# EAGLE design Stefan 2.0 (EAGLE 9.6.2)

## Sheet 1 of 2
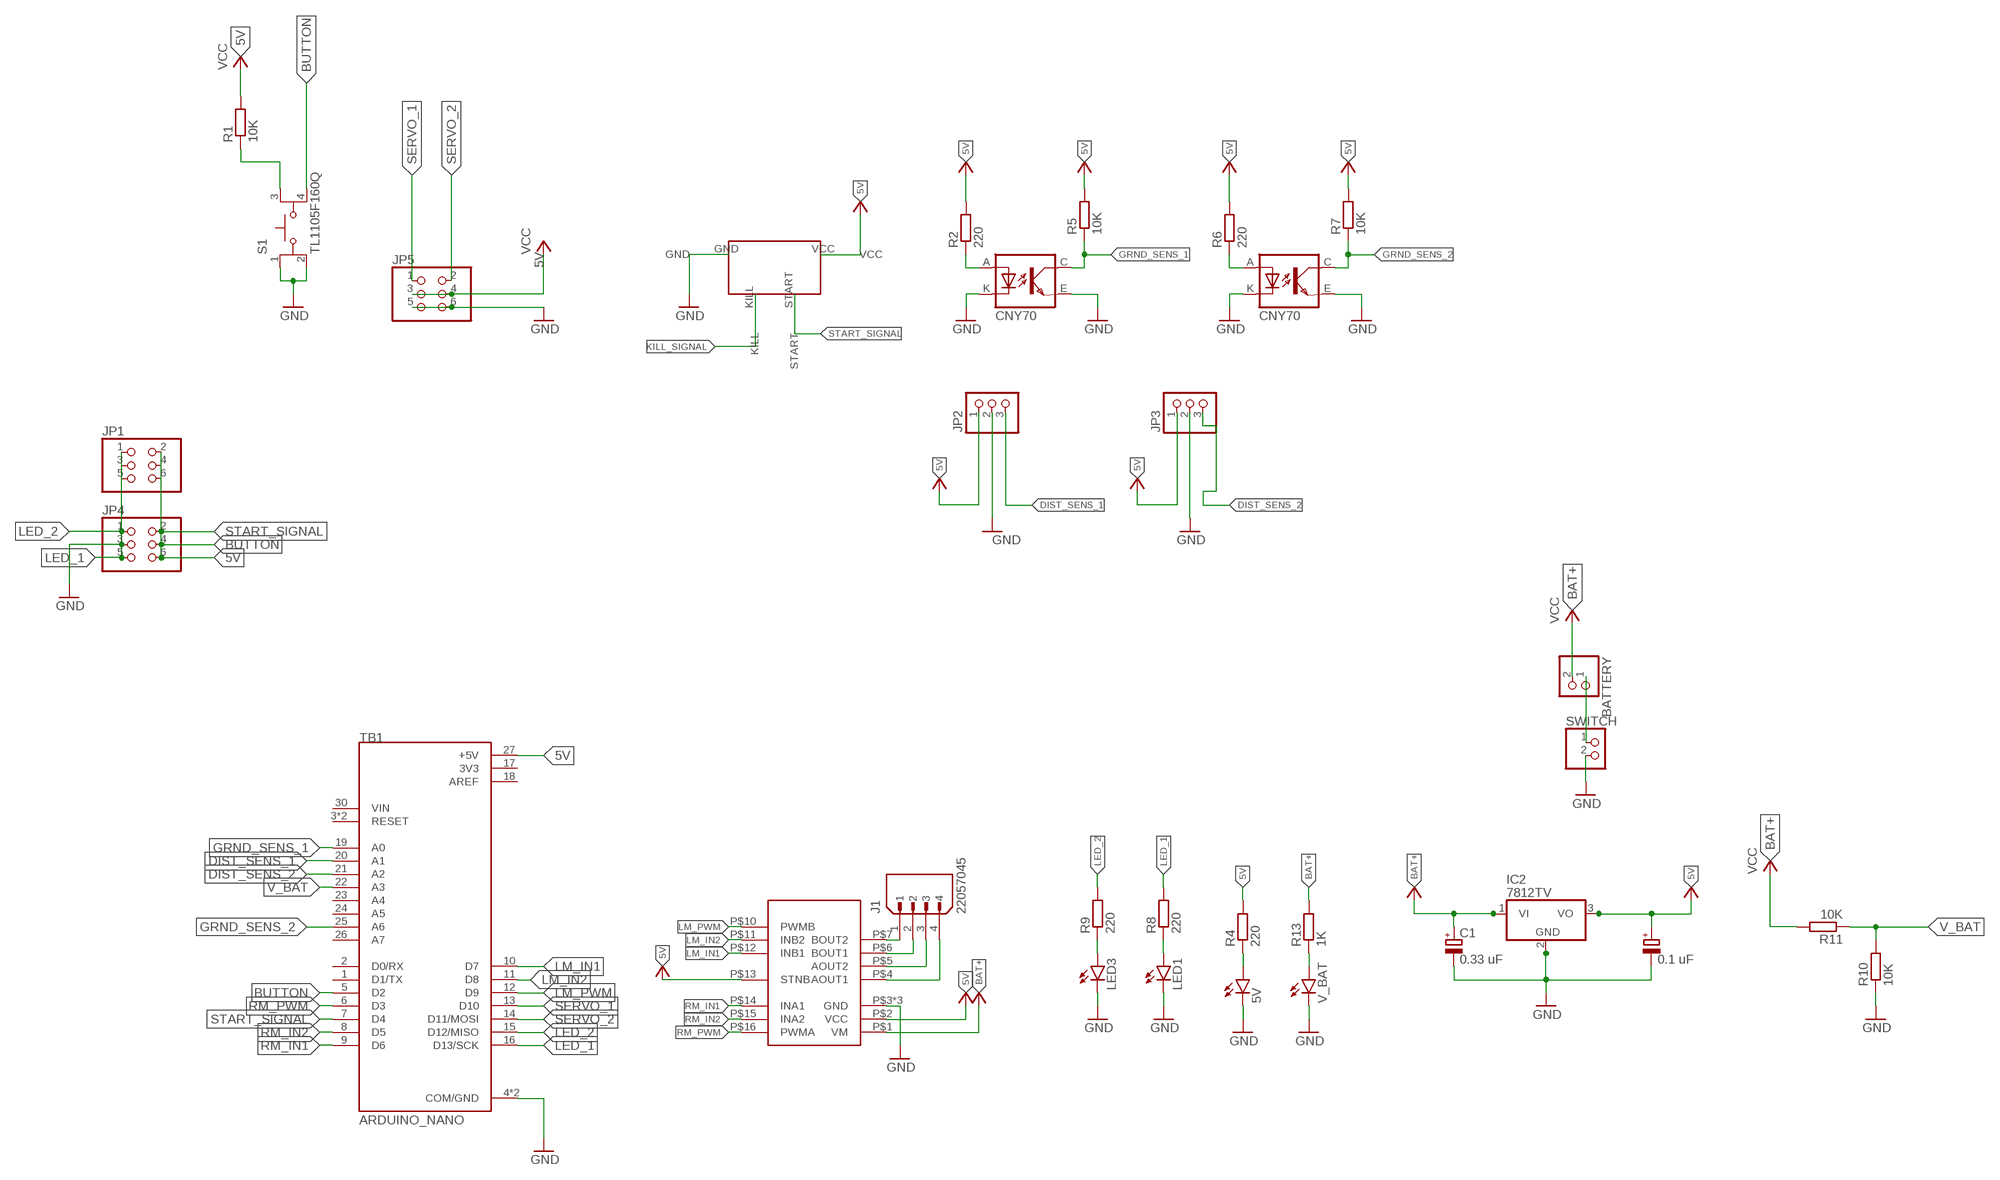
[diagram p0: schematic, sheet 1]

### Parts
5V  LED5MM  [LED5MM]
BATTERY  PINHD-1X2  [1X02]
C1  0.33 uF  CPOL-EUTAP5-70  [TAP5-70]
C2  0.1 uF  CPOL-EUSANYO_A  [SANYO-OSCON_A]
IC2  7812TV  [TO220V]
J1  22057045  [MOLEX_22057045]
JP1  PINHD-2X3  [2X03]
JP2  PINHD-1X3  [1X03]
JP3  PINHD-1X3  [1X03]
JP4  PINHD-2X3  [2X03]
JP5  PINHD-2X3  [2X03]
LED1  LED5MM  [LED5MM]
LED3  LED5MM  [LED5MM]
R1  10K  R-EU_R0805  [R0805]
R2  220  R-EU_R0805  [R0805]
R4  220  R-EU_R0805  [R0805]
R5  10K  R-EU_R0805  [R0805]
R6  220  R-EU_R0805  [R0805]
R7  10K  R-EU_R0805  [R0805]
R8  220  R-EU_R0805  [R0805]
R9  220  R-EU_R0805  [R0805]
R10  10K  R-EU_R0805  [R0805]
R11  10K  R-EU_R0805  [R0805]
R13  1K  R-EU_R0805  [R0805]
S1  TL1105F160Q  [SW_TL1105F160Q]
SUMO_START_MODULE1  SUMO_START_MODULE  [SUMO_START_MODULE]
SWITCH  PINHD-1X2  [1X02]
TB1  ARDUINO_NANO  [SHIELD_ARDUINO_NANO]
TB2  TB6612MODULE  [TB6612MODULE]
U$2  CNY70  [4]
U$4  CNY70  [4]
V_BAT  LEDCHIPLED_1206  [CHIPLED_1206]

### Nets
5V: C2.+ IC2.3(VO) JP1.6 JP2.1 JP3.1 JP4.6 JP5.3 JP5.4 R1.2 R2.2 R4.2 R5.2 R6.2 R7.2 SUMO_START_MODULE1.VCC TB1.27(+5V) TB2.P$2(VCC) TB2.P$13(STNB) ; supply symbol labelled VCC
BAT+: BATTERY.2 C1.+ IC2.1(VI) R11.2 R13.2 TB2.P$1(VM) ; supply symbol labelled VCC
BUTTON: JP1.4 JP4.4 S1.4 TB1.5(D2)
DIST_SENS_1: JP2.3 TB1.20(A1)
DIST_SENS_2: JP3.3 TB1.21(A2)
GND: 5V.K(C) C1.- C2.- IC2.2(GND) JP1.3 JP2.2 JP3.2 JP4.3 JP5.5 JP5.6 LED1.K(C) LED3.K(C) R10.1 S1.1 S1.2 SUMO_START_MODULE1.GND SWITCH.2 TB1.4(COM/GND) TB1.29(COM/GND) TB2.P$3(GND) TB2.P$8(GND) TB2.P$9(GND) U$2.E(EMI) U$2.K(C) U$4.E(EMI) U$4.K(C) V_BAT.C
GRND_SENS_1: R5.1 TB1.19(A0) U$2.C(COL)
GRND_SENS_2: R7.1 TB1.25(A6) U$4.C(COL)
KILL_SIGNAL: SUMO_START_MODULE1.KILL
LED_1: JP1.5 JP4.5 R8.2 TB1.16(D13/SCK)
LED_2: JP1.1 JP4.1 R9.2 TB1.15(D12/MISO)
LM_IN1: TB1.10(D7) TB2.P$12(INB1)
LM_IN2: TB1.11(D8) TB2.P$11(INB2)
LM_OUT1: J1.2 TB2.P$6(BOUT1)
LM_OUT2: J1.1 TB2.P$7(BOUT2)
LM_PWM: TB1.12(D9) TB2.P$10(PWMB)
N$1: BATTERY.1 SWITCH.1
N$6: LED3.A R9.1
N$8: R2.1 U$2.A
N$9: R6.1 U$4.A
N$10: LED1.A R8.1
N$13: 5V.A R4.1
N$15: R13.1 V_BAT.A
N$16: R1.1 S1.3
RM_IN1: TB1.9(D6) TB2.P$14(INA1)
RM_IN2: TB1.8(D5) TB2.P$15(INA2)
RM_OUT1: J1.4 TB2.P$4(AOUT1)
RM_OUT2: J1.3 TB2.P$5(AOUT2)
RM_PWM: TB1.6(D3) TB2.P$16(PWMA)
SERVO_1: JP5.1 TB1.13(D10)
SERVO_2: JP5.2 TB1.14(D11/MOSI)
START_SIGNAL: JP1.2 JP4.2 SUMO_START_MODULE1.START TB1.7(D4)
V_BAT: R10.2 R11.1 TB1.22(A3)
Unconnected: TB1.1(D1/TX) TB1.2(D0/RX) TB1.3(RESET) TB1.23(A4) TB1.24(A5) TB1.26(A7) TB1.28(RESET) TB1.30(VIN)

## Sheet 2 of 2
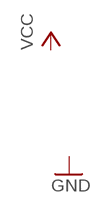
[diagram p1: schematic, sheet 2]

## Power pins joined to a net without a drawn wire
3V3: TB1.17(3V3)
AREF: TB1.18(AREF)

## Library data of the parts
5V LED1 LED3 V_BAT = led:LED: LED OSRAM: - CHIPLED LG R971, LG N971, LY N971, LG Q971, LY Q971, LO R971, LY R971 LH N974, LH R974 LS Q976, LO Q976, LY Q976 LO Q996 - Hyper CHIPLED LW Q18S LB Q993, LB Q99A, LB R99A - SideLED LS A670, LO A670, LY A670, LG A670, LP A670 LB A673, LV A673, LT A673, LW A673 LH A674 LY A675 LS A676, LA A676, LO A676, LY A676, LW A676 LS A679, LY A679, LG A679 - Hyper Micro SIDELED® LS Y876, LA Y876, LO Y876, LY Y876 LT Y87S - SmartLED LW L88C, LW L88S LB L89C, LB L89S, LG L890 LS L89K, LO L89K, LY L89K LS L896, LA L896, LO L896, LY L896 - TOPLED LS T670, LO T670, LY T670, LG T670, LP T670 LSG T670, LSP T670, LSY T670, LOP T670, LYG T670 LG T671, LOG T671, LSG T671 LB T673, LV T673, LT T673, LW T673 LH T674 LS T676, LA T676, LO T676, LY T676, LB T676, LH T676, LSB T676, LW T676 LB T67C, LV T67C, LT T67C, LS T67K, LO T67K, LY T67K, LW E67C LS E67B, LA E67B, LO E67B, LY E67B, LB E67C, LV E67C, LT E67C LW T67C LS T679, LY T679, LG T679 LS T770, LO T770, LY T770, LG T770, LP T770 LB T773, LV T773, LT T773, LW T773 LH T774 LS E675, LA E675, LY E675, LS T675 LS T776, LA T776, LO T776, LY T776, LB T776 LHGB T686 LT T68C, LB T68C - Hyper Mini TOPLED® LB M676 - Mini TOPLED Santana® LG M470 LS M47K, LO M47K, LY M47K Source: http://www.osram.convergy.de LUXEON: - LUMILED® LXK2-PW12-R00, LXK2-PW12-S00, LXK2-PW14-U00, LXK2-PW14-V00 LXK2-PM12-R00, LXK2-PM12-S00, LXK2-PM14-U00 LXK2-PE12-Q00, LXK2-PE12-R00, LXK2-PE12-S00, LXK2-PE14-T00, LXK2-PE14-U00 LXK2-PB12-K00, LXK2-PB12-L00, LXK2-PB12-M00, LXK2-PB14-N00, LXK2-PB14-P00, LXK2-PB14-Q00 LXK2-PR12-L00, LXK2-PR12-M00, LXK2-PR14-Q00, LXK2-PR14-R00 LXK2-PD12-Q00, LXK2-PD12-R00, LXK2-PD12-S00 LXK2-PH12-R00, LXK2-PH12-S00 LXK2-PL12-P00, LXK2-PL12-Q00, LXK2-PL12-R00 Source: www.luxeon.com KINGBRIGHT: KA-3528ASYC Source: www.kingbright.com
BATTERY SWITCH = pinhead:PINHD-1X2: PIN HEADER
C1 C2 = rcl:CPOL-EU: POLARIZED CAPACITOR, European symbol; SPICEPREFIX: C
IC2 = linear:78*: Positive VOLTAGE REGULATOR Source: http://cache.national.com/ds/LM/LM78L05.pdf http://www.fairchildsemi.com/ds/LM/LM7805.pdf
J1 = 22057045:22057045: 2.50mm Pitch, Mini-SPOX PCB Header, Single Row, Through Hole, Tin Plating, Friction Lock, 4 Circuits, Bag, 3.50mm PC Tail Length Check availability <https://pricing.snapeda.com/parts/22057045/Molex/view-part?ref=eda>; AVAILABILITY: In Stock; DESCRIPTION: Conn Shrouded Header (4 Sides) HDR 4 POS 2.5mm Solder RA Side Entry Thru-Hole SPOX™ Bag; MF: Molex; MP: 22057045; PACKAGE: None; PRICE: None
JP1 JP4 JP5 = pinhead:PINHD-2X3: PIN HEADER
JP2 JP3 = pinhead:PINHD-1X3: PIN HEADER
R1 R2 R4-R11 R13 = rcl:R-EU_: RESISTOR, European symbol; SPICEPREFIX: R
S1 = TL1105F160Q:TL1105F160Q: Check availability <https://pricing.snapeda.com/parts/TL1105F160Q/E-Switch/view-part?ref=eda>; AVAILABILITY: In Stock; DESCRIPTION: SWITCH TACTILE SPST-NO 0.05A 12V; MF: E-Switch; MP: TL1105F160Q; PACKAGE: None; PRICE: None; PURCHASE-URL: https://pricing.snapeda.com/search/part/TL1105F160Q/?ref=eda
SUMO_START_MODULE1 = SUMO_START_MODULE:SUMO_START_MODULE
TB1 = ARDUINO_NANO:ARDUINO_NANO: Arduino Nano, Through Hole Check availability <https://pricing.snapeda.com/parts/Arduino%20Nano/Arduino/view-part?ref=eda>; AVAILABILITY: Not in stock; DESCRIPTION: Small, complete, and breadboard-friendly board based on the ATmega328 (Arduino Nano 3.x); MF: Arduino; MP: Arduino Nano; PACKAGE: Non-Standard Arduino; PRICE: None
TB2 = TB6612MODULE:TB6612MODULE
U$2 U$4 = CNY70:CNY70: Check availability <https://pricing.snapeda.com/parts/CNY70/Vishay%20Semiconductors/view-part?ref=eda>; AVAILABILITY: In Stock; DESCRIPTION: Optical Switches, Reflective, Phototransistor Output Reflective Optical Sensor w/Trans Out; MF: Vishay Semiconductors; MP: CNY70; PACKAGE: None; PRICE: None; PURCHASE-URL: https://pricing.snapeda.com/search/part/CNY70/?ref=eda

## Board
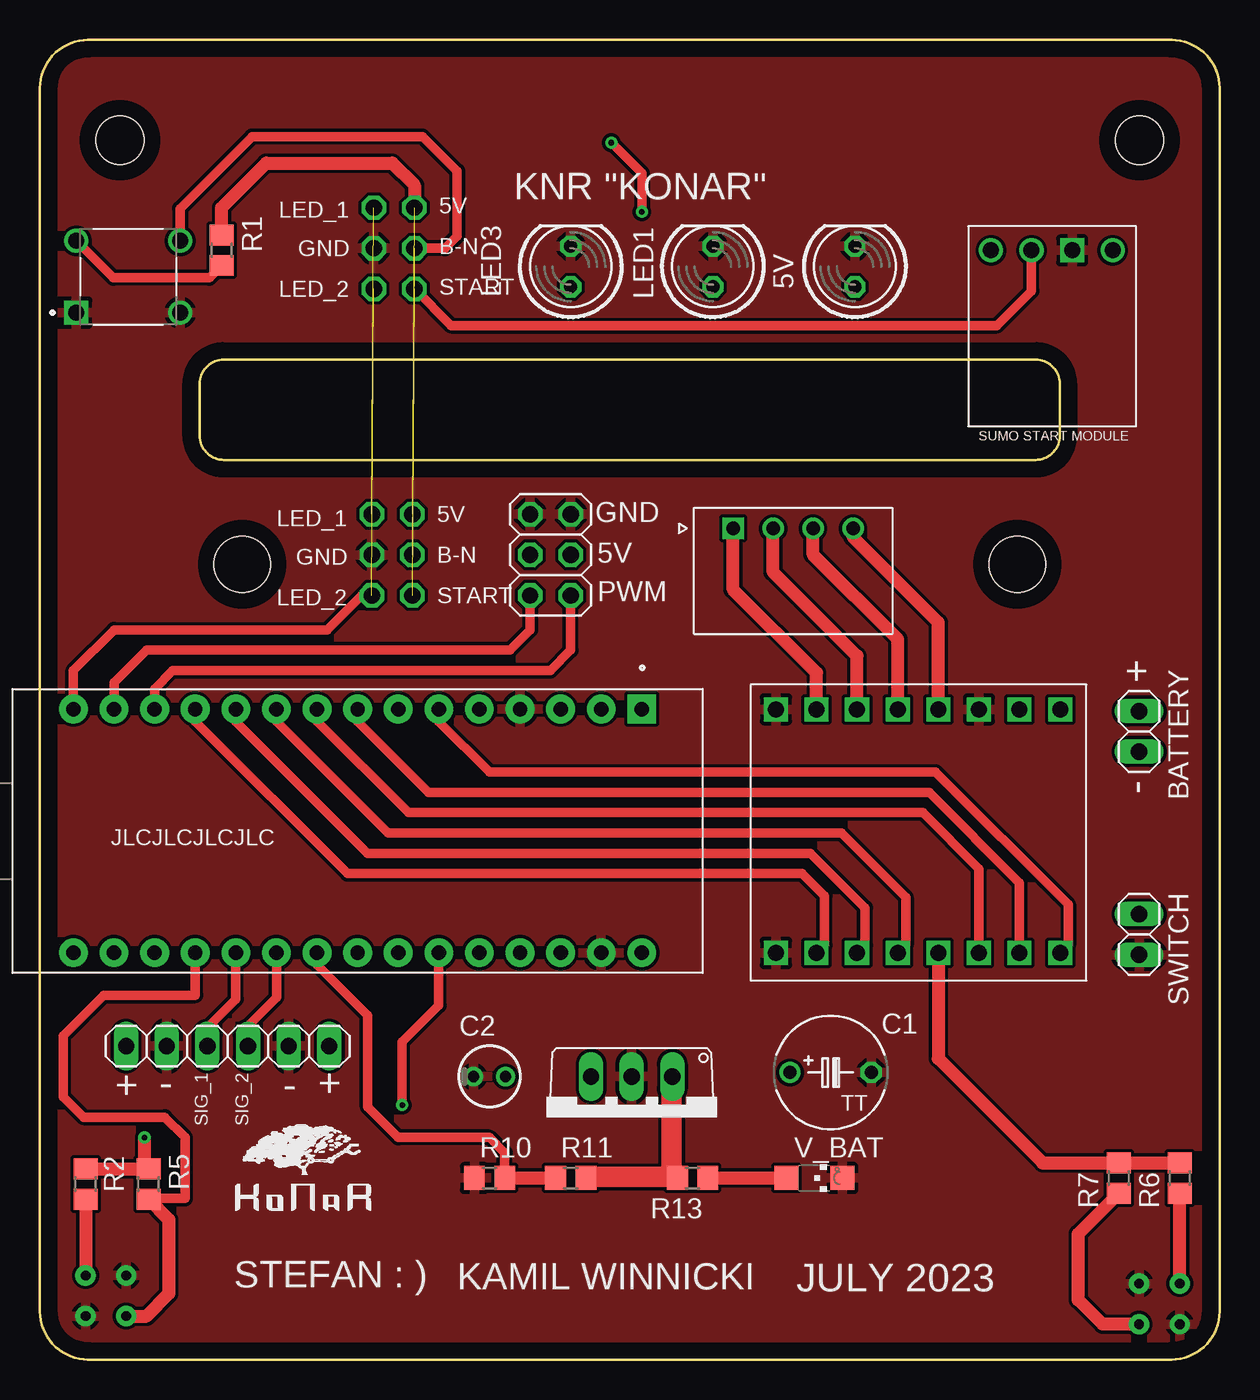
[diagram p2: board, top side]
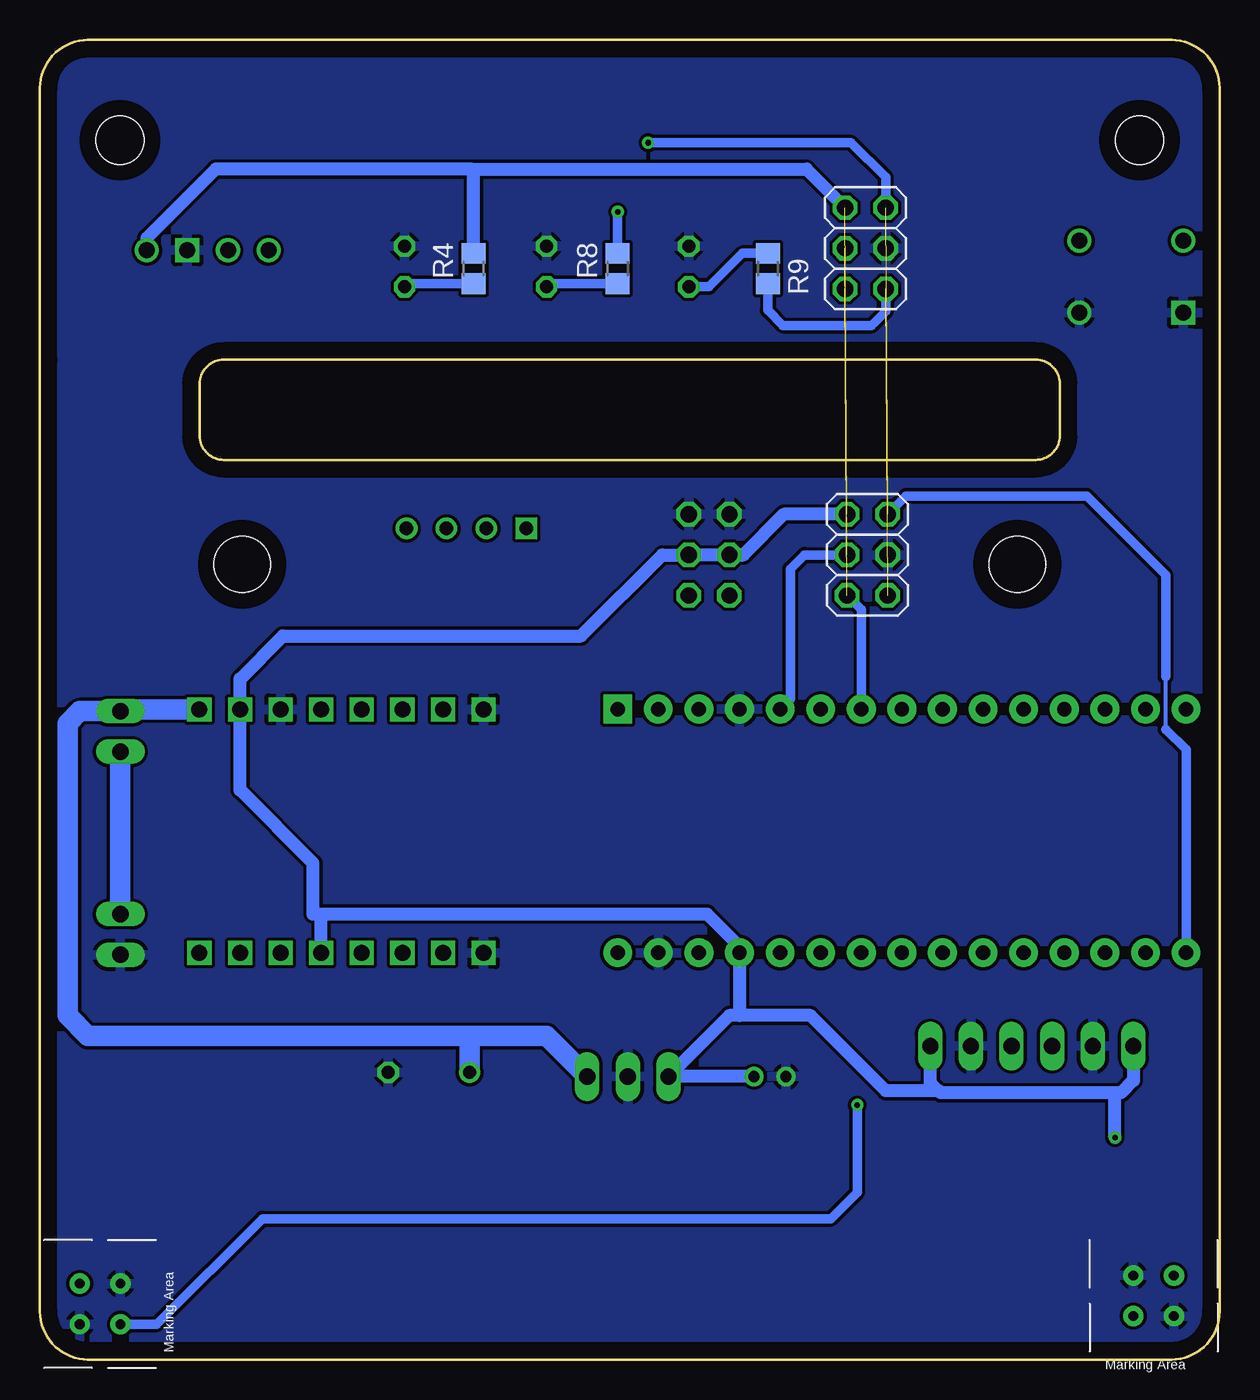
[diagram p3: board, bottom side, seen from below]

Size 73.8 x 82.56 mm. Coordinates in mm from the lower left corner, seen from the top.
Outline: 63.8,61.05 arc90 62.3,62.55 11.5,62.55 arc90 10,61.05 10,57.78 arc90 11.5,56.28 62.3,56.28 arc90 63.8,57.78 63.8,61.05
Outline: 70.8,82.55 3,82.55 arc90 0,79.55 0,3 arc90 3,0 70.8,0 arc90 73.8,3 73.8,62.55 73.8,79.55 arc90 70.8,82.55
Copper layers (1*16): Top 0.035mm / dielectric 1.5mm / Bottom 0.035mm
Design rules "default *": minimum track width 6mil, minimum drill 0.35mm, track to track 8mil, track to pad 8mil, pad to pad 8mil, via to via 8mil, smd to smd 8mil, copper to edge 40mil, drill to drill 6mil, minimum pad ring 10mil, minimum via ring 8mil, stop-mask expansion 4mil, vias tented up to drill 0mil, thermal gap 10mil
Holes 3.5 mm at 61.15,49.76 12.65,49.76
Holes 3 mm at 68.8,76.29 5,76.29

### Footprints (pad centres in the part's own frame; a part is rotated, then mirrored left to right if it is on the bottom)
LED5MM = drill 0.813 octagon: A -1.27,0; K 1.27,0
1X02 = drill 1.016 long: 1 -1.27,0; 2 1.27,0
TAP5-70 = drill 0.813: + -2.54,0 | drill 0.813 octagon: - 2.54,0
SANYO-OSCON_A = drill 0.7 pad 1.1: + 1,0; - -1,0
TO220V = drill 1.016 long: 1 -2.54,-2.54; 2 0,-2.54; 3 2.54,-2.54
MOLEX_22057045 = drill 0.85 pad 1.2 square: 1 0,0 | drill 0.85 pad 1.2: 2 2.5,0; 3 5,0; 4 7.5,0
2X03 = drill 1.016 octagon: 1 -2.54,-1.27; 2 -2.54,1.27; 3 0,-1.27; 4 0,1.27; 5 2.54,-1.27; 6 2.54,1.27
1X03 = drill 1.016 long: 1 -2.54,0; 2 0,0; 3 2.54,0
R0805 = smd 1.3 x 1.5: 1 -0.95,0; 2 0.95,0
SW_TL1105F160Q = drill 1 square: 1 -3.25,-2.25 | drill 1: 2 3.25,-2.25; 3 -3.25,2.25; 4 3.25,2.25
SUMO_START_MODULE = drill 1 square: GND 0,0 | drill 1: KILL 5.08,0; START 2.54,0; VCC -2.54,0
SHIELD_ARDUINO_NANO = drill 0.9 pad 1.8 square: 1 -7.62,17.78 | drill 0.9 pad 1.8: 2 -7.62,15.24; 3 -7.62,12.7; 4 -7.62,10.16; 5 -7.62,7.62; 6 -7.62,5.08; 7 -7.62,2.54; 8 -7.62,0; 9 -7.62,-2.54; 10 -7.62,-5.08; 11 -7.62,-7.62; 12 -7.62,-10.16; 13 -7.62,-12.7; 14 -7.62,-15.24; 15 -7.62,-17.78; 16 7.62,-17.78; 17 7.62,-15.24; 18 7.62,-12.7; 19 7.62,-10.16; 20 7.62,-7.62; 21 7.62,-5.08; 22 7.62,-2.54; 23 7.62,0; 24 7.62,2.54; 25 7.62,5.08; 26 7.62,7.62; 27 7.62,10.16; 28 7.62,12.7; 29 7.62,15.24; 30 7.62,17.78
TB6612MODULE = drill 1 square: P$1 1.64,1.54; P$2 4.18,1.54; P$3 6.72,1.54; P$4 9.26,1.54; P$5 11.8,1.54; P$6 14.34,1.54; P$7 16.88,1.54; P$8 19.42,1.54; P$9 19.42,16.78; P$10 16.88,16.78; P$11 14.34,16.78; P$12 11.8,16.78; P$13 9.26,16.78; P$14 6.72,16.78; P$15 4.18,16.78; P$16 1.64,16.78
4 = drill 0.61 pad 1.27: A -1.27,1.27; C 1.27,-1.27; E 1.27,1.27; K -1.27,-1.27
CHIPLED_1206 = smd 1.5 x 1.5: A 0,-1.75; C 0,1.75

### Placement (x,y rotation side)
5V  50.99,68.38 90 top
BATTERY  68.77,39.3 90 top
C1  49.46,17.96 0 top
C2  28.13,17.71 0 top
IC2  37.02,15.17 180 top
J1  43.37,52 0 top
JP1  22.03,50.34 90 bottom
JP2  7.94,19.61 0 top
JP3  15.56,19.61 180 top
JP4  22.16,69.52 90 bottom
JP5  31.94,50.34 90 top
LED1  42.1,68.38 90 top
LED3  33.21,68.38 90 top
R1  11.36,69.39 90 top
R2  2.86,10.97 90 top
R4  46.67,68.25 90 bottom
R5  6.79,10.97 90 top
R6  71.31,11.36 90 top
R7  67.5,11.36 90 top
R8  37.65,68.25 90 bottom
R9  28.26,68.25 270 bottom
R10  28.13,11.36 0 top
R11  33.21,11.36 0 top
R13  40.83,11.36 180 top
S1  5.52,67.74 0 top
SUMO_START_MODULE1  64.58,69.39 180 top
SWITCH  68.77,26.6 270 top
TB1  19.87,33.07 270 top
TB2  65.47,42.22 180 top
U$2  4.13,3.99 270 bottom
U$4  70.04,3.48 0 bottom
V_BAT  48.45,11.36 270 top

### Tracks (layer width: path | path; a pad name or v marks a point on that pad's centre or on a via)
5V  (via drill 0.35)  (1 unrouted)
  Top 0.813: R2.2 R5.2 6.54,12.18 v6.54,13.9 | R6.2 R7.2 62.74,12.31 56.21,18.84 TB2.P$13 | R1.2 11.36,72.06 14.16,74.86 22.03,74.86 23.43,73.46 JP4.6
  Bottom 0.813: TB2.P$13 56.21,27.87 | 56.21,27.87 56.71,27.87 56.71,31.05 61.29,35.62 TB2.P$2 61.29,42.59 58.61,45.26 39.94,45.26 34.86,50.34 JP5.3 JP5.4 29.78,50.34 27.24,52.88 JP1.6 | 56.21,27.87 32.07,27.87 30.03,25.83 TB1.27 30.03,21.52 | C2.+ IC2.3 30.67,21.52 30.03,21.52 | JP2.1 5.4,17.45 6.16,16.69 6.54,16.69 | 6.54,16.69 17.46,16.69 17.59,16.82 | 17.59,16.82 18.1,17.32 JP3.1 | 17.59,16.82 20.89,16.82 25.59,21.52 30.03,21.52 | v6.54,13.9 6.54,16.69 | R4.2 46.67,74.35 46.8,74.47 | 46.8,74.47 25.84,74.47 JP4.6 | SUMO_START_MODULE1.VCC 67.12,70.16 62.8,74.47 46.8,74.47
BAT+
  Top 1.27: 39.81,11.42 39.5,11.74 39.5,17.64 IC2.1 | 39.81,11.42 R13.2 | R11.2 34.22,11.42 39.81,11.42
  Bottom 0.813: 46.92,19.99 47.18,20.25
  Bottom 1.27: TB2.P$1 68.66,40.68 BATTERY.2 71.31,40.57 72.07,39.8 72.07,21.52 70.8,20.25 47.18,20.25 42.1,20.25 IC2.1 | C1.+ 46.92,19.99
BUTTON  (1 unrouted)
  Top 0.61: JP4.4 25.33,69.52 26.1,70.28 26.1,74.35 23.94,76.51 13.27,76.51 8.77,72.01 S1.4
  Bottom 0.61: TB1.5 26.86,41.33 26.86,49.46 25.97,50.34 JP1.4
DIST_SENS_1
  Top 0.61: JP2.3 10.48,20.75 12.25,22.53 TB1.20
DIST_SENS_2
  Top 0.61: JP3.3 13.02,20.88 14.79,22.66 TB1.21
GND
  pour Bottom: -4.89,1.2 -4.89,86.29 -3.62,87.56 78.93,87.56 78.93,-0.07 73.85,-5.15 1.46,-5.15
  pour Top: -4.89,1.2 1.46,-5.15 73.85,-5.15 78.93,-0.07 78.93,87.56 -3.62,87.56 -4.89,86.29
GRND_SENS_1
  Top 0.61: R5.1 6.85,10.09 9.08,10.09 9.08,13.9 7.81,15.17 2.73,15.17 1.46,16.44 1.46,20.25 4,22.79 9.71,22.79 TB1.19
  Top 0.813: U$2.C 6.67,2.72 8.06,4.12 8.06,8.75 R5.1
GRND_SENS_2  (via drill 0.35)
  Top 0.61: v22.67,15.93 22.67,19.86 24.95,22.15 TB1.25
  Top 0.813: U$4.C 66.48,2.21 64.96,3.74 64.96,7.87 R7.1
  Bottom 0.61: U$4.C 66.48,2.21 59.88,8.82 24.32,8.82 22.67,10.47 v22.67,15.93
LED_1  (via drill 0.35)  (1 unrouted)
  Top 0.61: v35.75,76.13 37.65,74.22 v37.65,71.81
  Bottom 0.254: 3.36,39.42 3.36,42.72
  Bottom 0.61: TB1.16 2.09,38.15 3.36,39.42 | 3.36,42.72 3.36,49.07 8.32,54.03 19.62,54.03 JP1.5 | JP4.5 20.89,73.97 23.05,76.13 v35.75,76.13 | v37.65,71.81 R8.2
LED_2  (1 unrouted)
  Top 0.61: TB1.15 2.09,43.11 4.63,45.65 17.97,45.65 20.13,47.8 JP1.1
  Bottom 0.61: JP4.1 20.89,65.58 21.78,64.7 27.3,64.7 28.26,65.65 R9.2
LM_IN1
  Top 0.61: TB1.10 14.79,39.93 21.78,32.95 50.14,32.95 54.16,28.92 54.16,25.93 TB2.P$12
LM_IN2
  Top 0.61: TB1.11 12.25,39.93 20.51,31.68 48.21,31.68 51.62,28.26 51.62,25.93 TB2.P$11
LM_OUT1
  Top 0.813: TB2.P$6 51.13,44.02 45.87,49.28 J1.2
LM_OUT2
  Top 0.813: TB2.P$7 48.59,42.97 43.37,48.19 J1.1
LM_PWM
  Top 0.61: TB1.12 9.71,39.93 19.24,30.41 47.69,30.41 49.08,29.01 49.08,25.93 TB2.P$10
N$1
  Bottom 1.27: SWITCH.1 BATTERY.1
N$6
  Bottom 0.61: R9.1 29.85,69.2 31.94,67.11 LED3.A
N$8
  Top 0.813: R2.1 U$2.A
N$9
  Top 0.813: U$4.A R6.1
N$10
  Bottom 0.61: R8.1 41.91,67.3 LED1.A
N$13
  Bottom 0.61: R4.1 50.8,67.3 5V.A
N$15
  Top 0.813: R13.1 V_BAT.A
N$16
  Top 0.61: S1.3 4.58,67.68 10.6,67.68 R1.1
RM_IN1
  Top 0.61: TB1.9 17.33,39.93 23.05,34.22 55.23,34.22 58.75,30.7 TB2.P$14
RM_IN2
  Top 0.61: TB1.8 19.87,39.93 24.32,35.49 55.63,35.49 61.29,29.83 TB2.P$15
RM_OUT1
  Top 0.813: TB2.P$4 56.21,46.12 50.87,51.46 J1.4
RM_OUT2
  Top 0.813: TB2.P$5 53.67,45.07 48.37,50.37 J1.3
RM_PWM
  Top 0.61: TB1.6 24.95,39.93 28.13,36.76 56.03,36.76 64.32,28.46 64.32,25.93 TB2.P$16
SERVO_1
  Top 0.61: TB1.13 7.17,41.96 8.32,43.11 31.94,43.11 33.21,44.38 JP5.1
SERVO_2
  Top 0.61: JP5.2 30.67,45.65 29.4,44.38 6.67,44.38 4.63,42.34 TB1.14
START_SIGNAL  (1 unrouted)
  Top 0.61: JP4.2 25.72,64.7 59.88,64.7 62.04,66.85 SUMO_START_MODULE1.START
  Bottom 0.61: JP1.2 22.41,46.92 TB1.7
V_BAT
  Top 0.61: R10.2 29.08,12.95 28.13,13.9 22.41,13.9 20.51,15.8 20.51,21.52 17.33,24.69 TB1.22
  Top 0.813: R10.2 R11.1

### Text on the board
tNames: LED_1 | KNR "KONAR" | 5V | GND | B-N | LED_2 | START | LED_1 | 5V | GND | GND | B-N | 5V | LED_2 | START | PWM | + | - | JLCJLCJLCJLC | + | - | SIG_1 | SIG_2 | - | + | STEFAN : ) | KAMIL WINNICKI | JULY 2023